# Altium schematic sheet CardV1.SchDoc
size A3
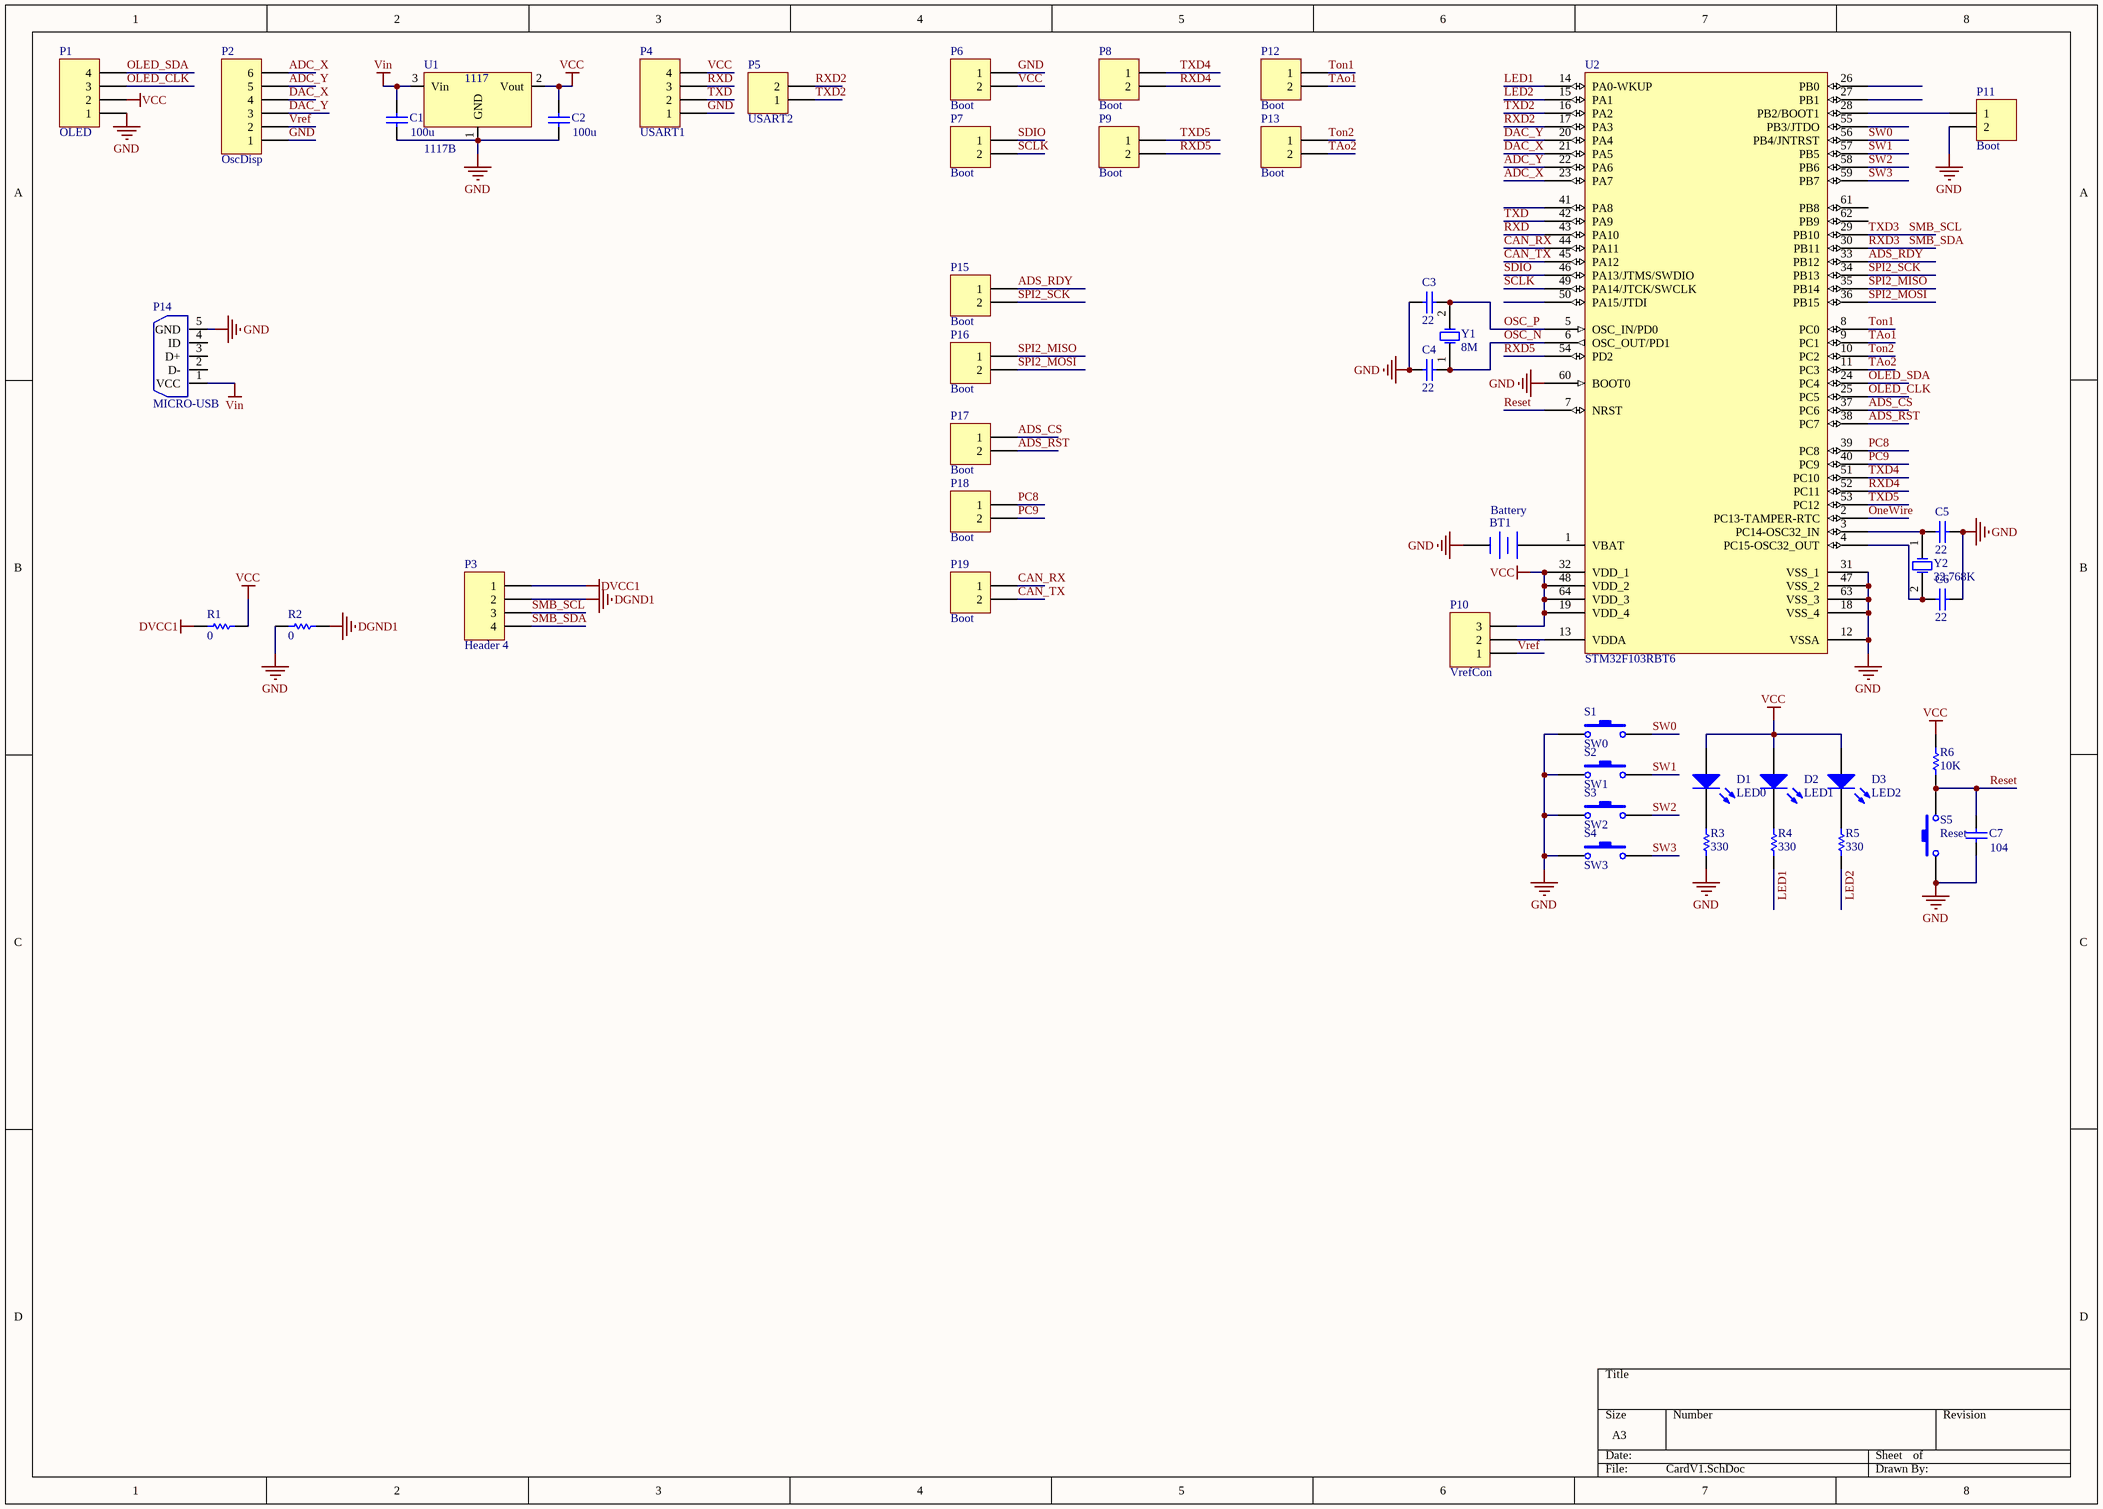
[diagram p0: CardV1.SchDoc]

## Parts
BT1  Battery  [Battery-OneSide]
C1  100u  [1608[0603]]
C2  100u  [1608[0603]]
C3  22  [1608[0603]]
C4  22  [1608[0603]]
C5  22  [1608[0603]]
C6  22  [1608[0603]]
C7  104  [3.2X1.6X1.1]
D1  LED0  [SMDLED]
D2  LED1  [SMDLED]
D3  LED2  [SMDLED]
P1  OLED  [HDR1X4]
P2  OscDisp  [Postage6]
P3  Header 4  [HDR1X4]
P4  USART1  [Postage4]
P5  USART2  [Postage2]
P6  Boot  [Switch2]
P7  Boot  [Switch2]
P8  Boot  [Switch2]
P9  Boot  [Switch2]
P10  VrefCon  [Switch3]
P11  Boot  [Switch2]
P12  Boot  [Switch2]
P13  Boot  [Switch2]
P14  MICRO-USB  [MICRO_USB5P_SOP]
P15  Boot  [Switch2]
P16  Boot  [Switch2]
P17  Boot  [Switch2]
P18  Boot  [Switch2]
P19  Boot  [Switch2]
R1  0  [0603P]
R2  0  [0603P]
R3  330  [0603P]
R4  330  [0603P]
R5  330  [0603P]
R6  10K  [0603P]
S1  SW0  [Key]
S2  SW1  [Key]
S3  SW2  [Key]
S4  SW3  [Key]
S5  Reset  [Key]
U1  1117B  [SOP-223]
U2  STM32F103RBT6  [LQFP64_N]
Y1  8M  [R38]
Y2  32.768K  [R38]

## Nets
DGND1: P3.2 R2.2
DVCC1: P3.1 R1.2
GND: BT1.2(-) C1.1 C2.1 C3.2 C4.1 C5.2 C6.2 C7.1 P1.1 P2.1 P4.1 P6.1 P11.2 P14.5(GND) R2.1 R3.2 S1.1 S2.1 S3.1 S4.1 S5.1 U1.1(GND) U2.12(VSSA) U2.18(VSS_4) U2.31(VSS_1) U2.47(VSS_2) U2.60(BOOT0) U2.63(VSS_3)
VCC: C2.2 D1.1(A) D2.1(A) D3.1(A) P1.2 P4.4 P6.2 P10.3 R1.1 R6.2 U1.2(Vout) U2.19(VDD_4) U2.32(VDD_1) U2.48(VDD_2) U2.64(VDD_3)
Vin: C1.2 P14.1(VCC) U1.3(Vin)
ADC_X: P2.6 U2.23(PA7)
ADC_Y: P2.5 U2.22(PA6)
ADS_CS: P17.1 U2.37(PC6)
ADS_RDY: P15.1 U2.33(PB12)
ADS_RST: P17.2 U2.38(PC7)
CAN_RX: P19.1 U2.44(PA11)
CAN_TX: P19.2 U2.45(PA12)
DAC_X: P2.4 U2.21(PA5)
DAC_Y: P2.3 U2.20(PA4)
LED1: R4.1 U2.14(PA0-WKUP)
LED2: R5.1 U2.15(PA1)
OLED_CLK: P1.3 U2.25(PC5)
OLED_SDA: P1.4 U2.24(PC4)
OneWire: U2.2(PC13-TAMPER-RTC)
OSC_N: C4.2 U2.6(OSC_OUT/PD1) Y1.1(OSC1)
OSC_P: C3.1 U2.5(OSC_IN/PD0) Y1.2(OSC2)
PC8: P18.1 U2.39(PC8)
PC9: P18.2 U2.40(PC9)
Reset: C7.2 R6.1 S5.2 U2.7(NRST)
RXD: P4.3 U2.43(PA10)
RXD2: P5.2 U2.17(PA3)
RXD3: P3.4 U2.30(PB11)  [also labelled SMB_SDA]
RXD4: P8.2 U2.52(PC11)
RXD5: P9.2 U2.54(PD2)
SCLK: P7.2 U2.49(PA14/JTCK/SWCLK)
SDIO: P7.1 U2.46(PA13/JTMS/SWDIO)
SMB_SCL: P3.3 U2.29(PB10)  [also labelled TXD3]
SPI2_MISO: P16.1 U2.35(PB14)
SPI2_MOSI: P16.2 U2.36(PB15)
SPI2_SCK: P15.2 U2.34(PB13)
SW0: S1.2 U2.56(PB4/JNTRST)
SW1: S2.2 U2.57(PB5)
SW2: S3.2 U2.58(PB6)
SW3: S4.2 U2.59(PB7)
TAo1: P12.2 U2.9(PC1)
TAo2: P13.2 U2.11(PC3)
Ton1: P12.1 U2.8(PC0)
Ton2: P13.1 U2.10(PC2)
TXD: P4.2 U2.42(PA9)
TXD2: P5.1 U2.16(PA2)
TXD4: P8.1 U2.51(PC10)
TXD5: P9.1 U2.53(PC12)
Vref: P2.2 P10.1
NetBT1_1: BT1.1(+) U2.1(VBAT)
NetC5_1: C5.1 U2.3(PC14-OSC32_IN) Y2.1(OSC1)
NetC6_1: C6.1 U2.4(PC15-OSC32_OUT) Y2.2(OSC2)
NetD1_2: D1.2(K) R3.1
NetD2_2: D2.2(K) R4.2
NetD3_2: D3.2(K) R5.2
NetP10_2: P10.2 U2.13(VDDA)
NetP11_1: P11.1 U2.28(PB2/BOOT1)

Not connected (* = marked no-connect by the designer): P14 2(D-) 3(D+) 4(ID); U2 26(PB0) 27(PB1) 41(PA8) 50(PA15/JTDI) 55(PB3/JTDO) 61(PB8) 62(PB9)

## Notes on the sheet
- (in symbol 1117B) 1117

## Library data of the parts
BT1 = Battery: Multicell Battery; Published: 24-Mar-1999; LatestRevisionDate: 17-Jul-2002; LatestRevisionNote: Re-released for DXP Platform.; PackageReference: BAT-2; Publisher: Altium Limited; PackageDescription: Battery; 2 Leads
C1-C7 = Cap: Capacitor; Published: 8-Jun-2000; LatestRevisionDate: 17-Jul-2002; LatestRevisionNote: Re-released for DXP Platform.; PackageReference: RAD-0.3; Publisher: Altium Limited; PackageDescription: Radial Cap, Thru-Hole; 2 Leads; 0.3 in Pin Spacing
D1-D3 = LED0: Typical INFRARED GaAs LED; Published: 8-Jun-2000; LatestRevisionDate: 08-Jul-2005; LatestRevisionNote: Mech Layer 1 removed.; PackageReference: LED-0; Publisher: Altium Limited; PackageDescription: LED; 2 Leads
P1 P3 P4 = Header 4: Header, 4-Pin; LatestRevisionDate: 17-Jul-2002; LatestRevisionNote: Re-released for DXP Platform.; Publisher: Altium Limited
P2 = Header 6: Header, 6-Pin; LatestRevisionDate: 17-Jul-2002; LatestRevisionNote: Re-released for DXP Platform.; Publisher: Altium Limited
P5-P9 P11-P13 P15-P19 = Header 2: Header, 2-Pin; LatestRevisionDate: 17-Jul-2002; LatestRevisionNote: Re-released for DXP Platform.; Publisher: Altium Limited
P10 = Header 3: Header, 3-Pin; LatestRevisionDate: 17-Jul-2002; LatestRevisionNote: Re-released for DXP Platform.; Publisher: Altium Limited
P14 = USB5
R1-R6 = Res1: Resistor; Published: 8-Jun-2000; LatestRevisionDate: 17-Jul-2002; LatestRevisionNote: Re-released for DXP Platform.; PackageReference: AXIAL-0.3; Publisher: Altium Limited; PackageDescription: Axial Device, Thru-Hole; 2 Leads; 0.3 in Pin Spacing
S1-S5 = SW-PB: Switch; Published: 24-Mar-1999; LatestRevisionDate: 17-Jul-2002; LatestRevisionNote: Re-released for DXP Platform.; PackageReference: SPST-2; Publisher: Altium Limited; PackageDescription: Switch; 2 Leads
U2 = STM32F103RBT6: STM32 ARM-based 32-bit MCU with 128 Kbytes Flash, 64-pin LQFP, Industrial Temperature; Published: 30-May-2008; DatasheetVersion: rev6, Mar-2008; PackageVersion: Mar-2008; PackageReference: LQFP64; Publisher: Altium Limited; PackageDescription: 64-Pin Low-Profile Quad Flat Pack, 10 x 10 mm Body, 0.5 mm Pitch (LQFP64); ComponentLink1Description: Manufacturer Link; ComponentLink1URL: www.st.com/stm32; ComponentLink2Description: Datasheet; ComponentLink2URL: http://www.st.com/stonline/products/literature/ds/13587.pdf
Y1 Y2 = XTAL: Crystal Oscillator; Published: 8-Jun-2000; LatestRevisionDate: 17-Jul-2002; LatestRevisionNote: Re-released for DXP Platform.; PackageReference: R38; Publisher: Altium Limited; PackageDescription: Crystal, Thru-Hole; 2 Leads; Body 3.1 x 8.2 mm (Dia.xH)